# EAGLE design wand_alpha (EAGLE 9.5.2)
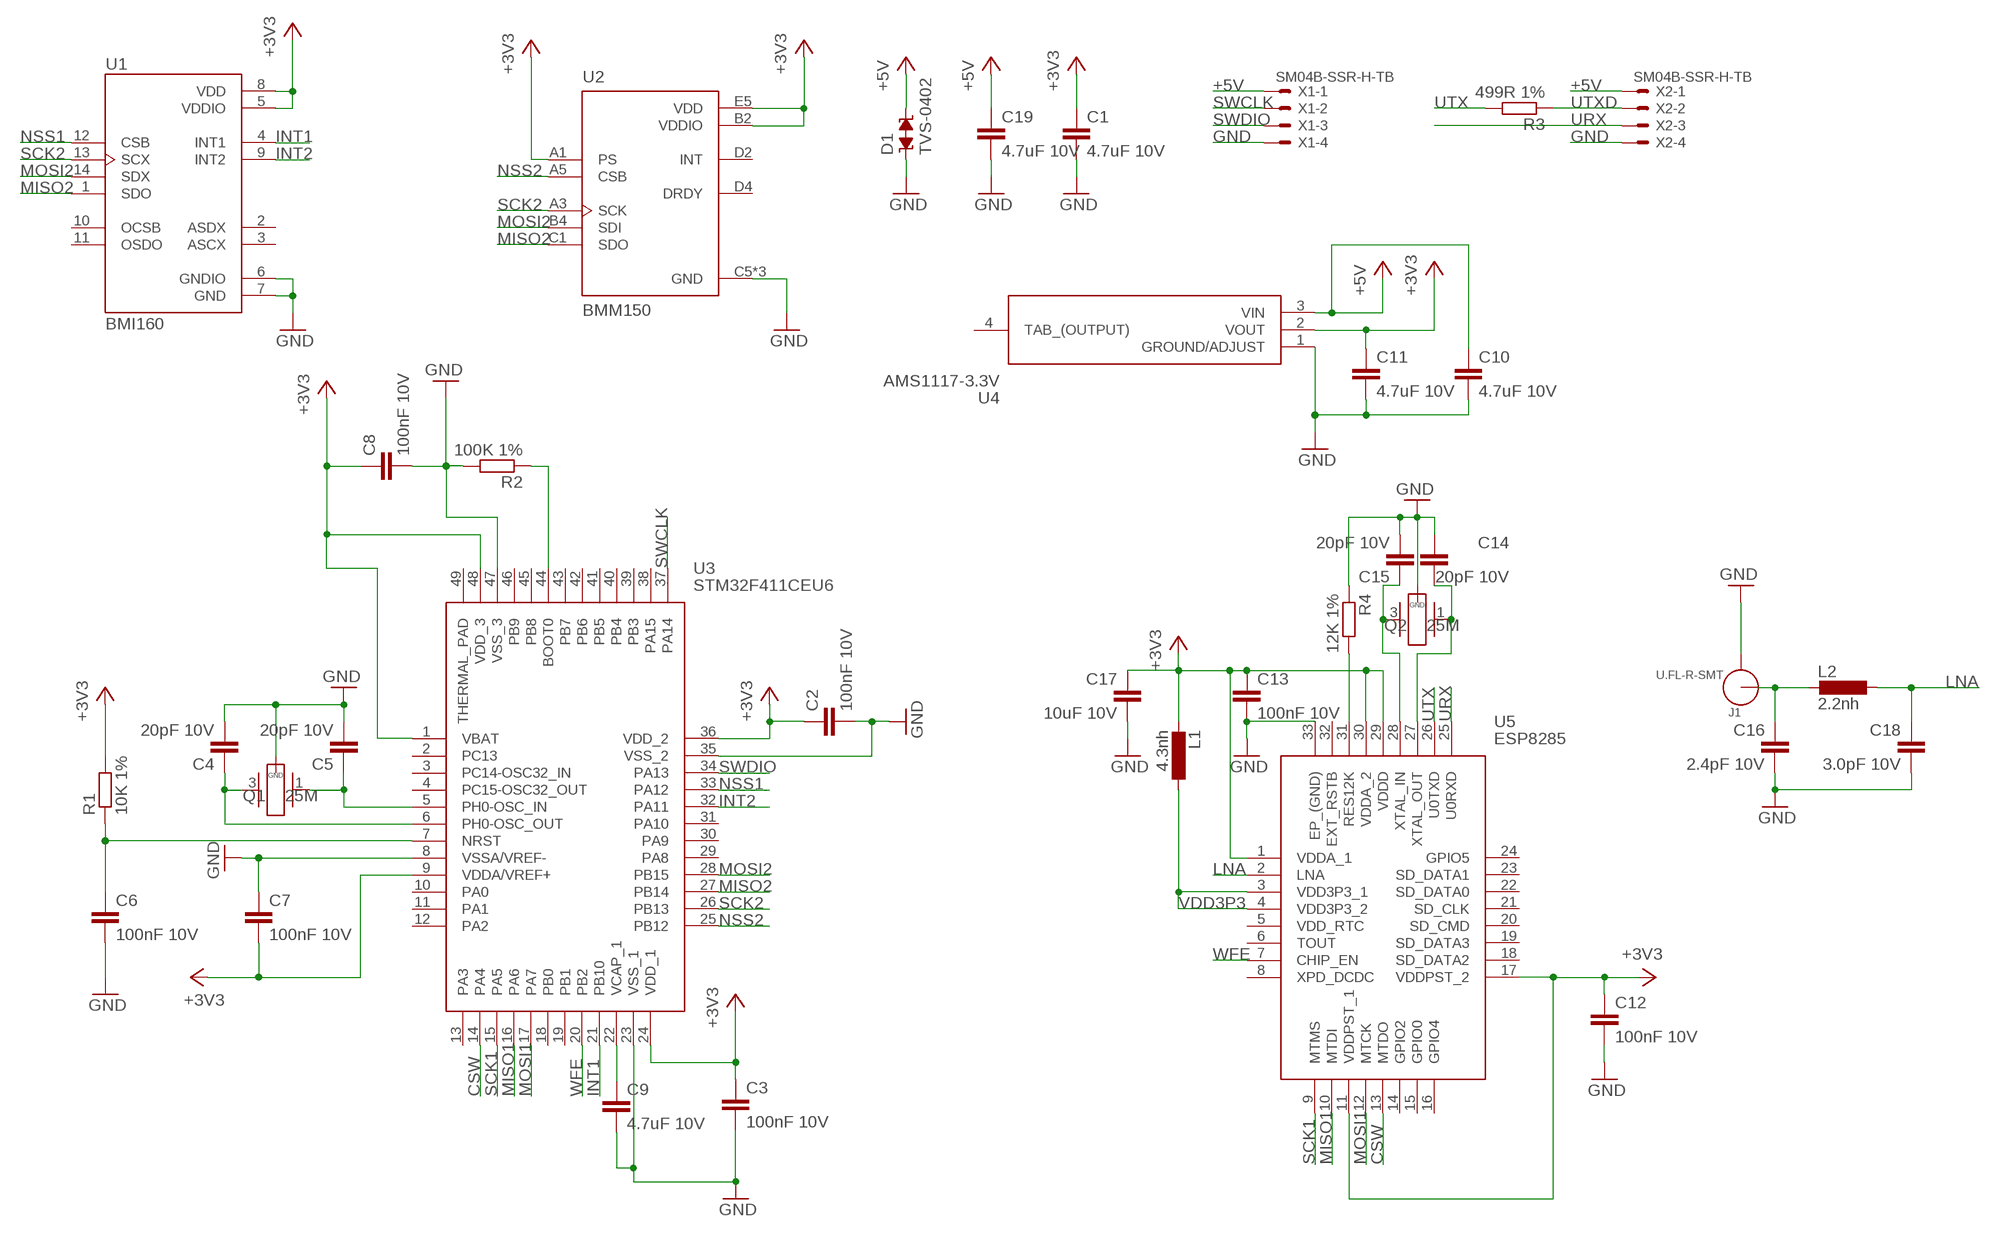
[diagram p0: schematic, sheet 1]

## Parts
C1  4.7uF 10V  C-EUC0402  [C0402]
C2  100nF 10V  C-EUC0402  [C0402]
C3  100nF 10V  C-EUC0402  [C0402]
C4  20pF 10V  C-EUC0402  [C0402]
C5  20pF 10V  C-EUC0402  [C0402]
C6  100nF 10V  C-EUC0402  [C0402]
C7  100nF 10V  C-EUC0402  [C0402]
C8  100nF 10V  C-EUC0402  [C0402]
C9  4.7uF 10V  C-EUC0402  [C0402]
C10  4.7uF 10V  C-EUC0402  [C0402]
C11  4.7uF 10V  C-EUC0402  [C0402]
C12  100nF 10V  C-EUC0402  [C0402]
C13  100nF 10V  C-EUC0402  [C0402]
C14  20pF 10V  C-EUC0402  [C0402]
C15  20pF 10V  C-EUC0402  [C0402]
C16  2.4pF 10V  C-EUC0402  [C0402]
C17  10uF 10V  C-EUC0402  [C0402]
C18  3.0pF 10V  C-EUC0402  [C0402]
C19  4.7uF 10V  C-EUC0402  [C0402]
D1  TVS-0402  [TVS0402]
J1  U.FL-R-SMT  [U.FL_SMT]
L1  4.3nh  L-EUL0402  [L0402]
L2  2.2nh  L-EUL0402  [L0402]
Q1  25M  FA-128  [FA-128]
Q2  25M  FA-128  [FA-128]
R1  10K 1%  R-EU_R0402  [R0402]
R2  100K 1%  R-EU_R0402  [R0402]
R3  499R 1%  R-EU_R0402  [R0402]
R4  12K 1%  R-EU_R0402  [R0402]
U1  BMI160  [PQFN50P300X250X88-14N]
U2  BMM150  [XDCR_BMM150]
U3  STM32F411CEU6  [QFN50P700X700X60-49N]
U4  AMS1117-3.3V  [SOT229P700X180-4N]
U5  ESP8285  [QFN50P500X500X90-33N]
X1  SM04B-SSR-H-TB  [SM04B-SSR-H-TB]
X2  SM04B-SSR-H-TB  [SM04B-SSR-H-TB]

## Nets
+3V3: C1.1 C2.1 C3.1 C7.2 C8.1 C11.1 C12.1 C13.1 C17.1 L1.2 R1.2 U1.5(VDDIO) U1.8(VDD) U2.A1(PS) U2.B2(VDDIO) U2.E5(VDD) U3.1(VBAT) U3.9(VDDA/VREF+) U3.24(VDD_1) U3.36(VDD_2) U3.48(VDD_3) U4.2(VOUT) U5.1(VDDA_1) U5.11(VDDPST_1) U5.17(VDDPST_2) U5.29(VDDD) U5.30(VDDA_2)
+5V: C10.1 C19.1 D1.2 U4.3(VIN) X1.1 X2.1
CSW: U3.14(PA4) U5.13(MTDO)
GND: C1.2 C2.2 C3.2 C4.2 C5.2 C6.2 C7.1 C8.2 C9.2 C10.2 C11.2 C12.2 C13.2 C14.2 C15.2 C16.2 C17.2 C18.2 C19.2 D1.1 J1.GND1 J1.GND2 Q1.2(GND) Q1.4(GND) Q2.2(GND) Q2.4(GND) R2.2 R4.1 U1.6(GNDIO) U1.7(GND) U2.C5(GND) U2.E1(GND) U2.E3(GND) U3.8(VSSA/VREF-) U3.23(VSS_1) U3.35(VSS_2) U3.47(VSS_3) U4.1(GROUND/ADJUST) U5.33(EP_(GND)) X1.4 X2.4
INT1: U1.4(INT1) U3.21(PB10)
INT2: U1.9(INT2) U3.32(PA11)
LNA: C18.1 L2.1 U5.2(LNA)
MISO1: U3.16(PA6) U5.10(MTDI)
MISO2: U1.1(SDO) U2.C1(SDO) U3.27(PB14)
MOSI1: U3.17(PA7) U5.12(MTCK)
MOSI2: U1.14(SDX) U2.B4(SDI) U3.28(PB15)
N$1: C4.1 Q1.3 U3.6(PH0-OSC_OUT)
N$2: C5.1 Q1.1 U3.5(PH0-OSC_IN)
N$3: C6.1 R1.1 U3.7(NRST)
N$4: R2.1 U3.44(BOOT0)
N$5: C9.1 U3.22(VCAP_1)
N$6: C16.1 J1.SIG(ANT) L2.2
N$7: C14.1 Q2.1 U5.27(XTAL_OUT)
N$8: C15.1 Q2.3 U5.28(XTAL_IN)
N$9: R4.2 U5.31(RES12K)
NSS1: U1.12(CSB) U3.33(PA12)
NSS2: U2.A5(CSB) U3.25(PB12)
SCK1: U3.15(PA5) U5.9(MTMS)
SCK2: U1.13(SCX) U2.A3(SCK) U3.26(PB13)
SWCLK: U3.37(PA14) X1.2
SWDIO: U3.34(PA13) X1.3
URX: U5.25(U0RXD) X2.3
UTX: R3.2 U5.26(U0TXD)
UTXD: R3.1 X2.2
VDD3P3: L1.1 U5.3(VDD3P3_1) U5.4(VDD3P3_2)
WFE: U3.20(PB2) U5.7(CHIP_EN)
Unconnected: U1.2(ASDX) U1.3(ASCX) U1.10(OCSB) U1.11(OSDO) U2.D2(INT) U2.D4(DRDY) U3.2(PC13) U3.3(PC14-OSC32_IN) U3.4(PC15-OSC32_OUT) U3.10(PA0) U3.11(PA1) U3.12(PA2) U3.13(PA3) U3.18(PB0) U3.19(PB1) U3.29(PA8) U3.30(PA9) U3.31(PA10) U3.38(PA15) U3.39(PB3) U3.40(PB4) U3.41(PB5) U3.42(PB6) U3.43(PB7) U3.45(PB8) U3.46(PB9) U3.49(THERMAL_PAD) U4.4(TAB_(OUTPUT)) U5.5(VDD_RTC) U5.6(TOUT) U5.8(XPD_DCDC) U5.14(GPIO2) U5.15(GPIO0) U5.16(GPIO4) U5.18(SD_DATA2) U5.19(SD_DATA3) U5.20(SD_CMD) U5.21(SD_CLK) U5.22(SD_DATA0) U5.23(SD_DATA1) U5.24(GPIO5) U5.32(EXT_RSTB)

## Library data of the parts
C1-C19 = rcl:C-EU: CAPACITOR, European symbol; SPICEPREFIX: C
D1 = supressor:TVS-: TVS BI-DIRECTIONAL
J1 = connector:U.FL-R-SMT: U.FL-R-SMT Antenna Connector; DIGIKEY: H122041-ND; MANUFACTURER: Hirose; MPN: U.FL-R-SMT-1(01)
L1 L2 = rcl-2:L-EU: INDUCTOR, European symbol
Q1 Q2 = crystals:FA-128: Epson MHz RANGE CRYSTAL UNIT ULTRA MINIATURE SIZE LOW PROFILE SMD http://www.digikey.com/product-search/en?FV=ffec63d1
R1-R4 = rcl:R-EU_: RESISTOR, European symbol; SPICEPREFIX: R
U1 = BMI160:BMI160: BMI160 2.5 x 3 mm Tiaxial Accelerometer / Gyroscope Inertial Measurement Unit; AVAILABILITY: Unavailable; DESCRIPTION: Accelerometer, Gyroscope, 6 Axis Sensor I²C, SPI Output; MF: Bosch; MP: BMI160; PACKAGE: LGA-14 Bosch; PRICE: None
U2 = BMM150:BMM150: BMM150 Series 3.6 V Surface Mount Three-Axis Geomagnetic Sensor - WLCSP-12; AVAILABILITY: Unavailable; DESCRIPTION: FlipCore, Hall Effect Sensor X, Y, Z Axis 12-WLCSP _1.56x1.56_; MF: Bosch Sensortec; MP: BMM150; PACKAGE: WLCSP-12 Bosch; PRICE: None
U3 = STM32F411CEU6:STM32F411CEU6: 32-Bit MCU 512K Flash 100MHz UFQFPN48 STMicroelectronics STM32F411CEU6, 32bit ARM Cortex M4 MCU, 100MHz, 512 kB Flash, 48-Pin UFQFPN Source: Datasheet <http://www.st.com/content/ccc/resource/technical/document/datasheet/b3/a5/46/3b/b4/e5/4c/85/DM00115249.pdf/files/DM00115249.pdf/jcr:content/translations/en.DM00115249.pdf>; DESCRIPTION: 32-Bit MCU 512K Flash 100MHz UFQFPN48 STMicroelectronics STM32F411CEU6, 32bit ARM Cortex M4 MCU, 100MHz, 512 kB Flash, 48-Pin UFQFPN; HEIGHT: 0.6mm; MANUFACTURER_NAME: STMicroelectronics; MANUFACTURER_PART_NUMBER: STM32F411CEU6; MOUSER_PART_NUMBER: 511-STM32F411CEU6; MOUSER_PRICE-STOCK: https://www.mouser.co.uk/ProductDetail/STMicroelectronics/STM32F411CEU6?qs=pjMTYa9MTGV3ou31YBFa3g%3D%3D
U4 = ams1117-3.3v:AMS1117-3.3V: 1A LOW DROPOUT VOLTAGE REGULATOR, SOT-223 Source: Datasheet <http://www.advanced-monolithic.com/pdf/ds1117.pdf>; DESCRIPTION: 1A LOW DROPOUT VOLTAGE REGULATOR, SOT-223; HEIGHT: 1.8mm; MANUFACTURER_NAME: Advanced Monolithic Systems; MANUFACTURER_PART_NUMBER: ams1117-3.3v
U5 = ESP8285:ESP8285: RF System on a Chip - SoC SMD IC ESP8285, 1MB SPI flash inside, QFN32-pin, 5x5mm Source: Datasheet <https://www.espressif.com/sites/default/files/documentation/0a-esp8285_datasheet_en.pdf>; DESCRIPTION: RF System on a Chip - SoC SMD IC ESP8285, 1MB SPI flash inside, QFN32-pin, 5x5mm; HEIGHT: 0.9mm; MANUFACTURER_NAME: Espressif Systems; MANUFACTURER_PART_NUMBER: ESP8285; MOUSER_PART_NUMBER: 356-ESP8285; MOUSER_PRICE-STOCK: https://www.mouser.co.uk/ProductDetail/Espressif-Systems/ESP8285?qs=chTDxNqvsyn49Ad%252BqWdhIQ%3D%3D
X1 X2 = con-jst2:SM04B-SSR-H-TB: Disconnectable Insulation displacement connector, 1.0mm pitch 4 contacts

## Board
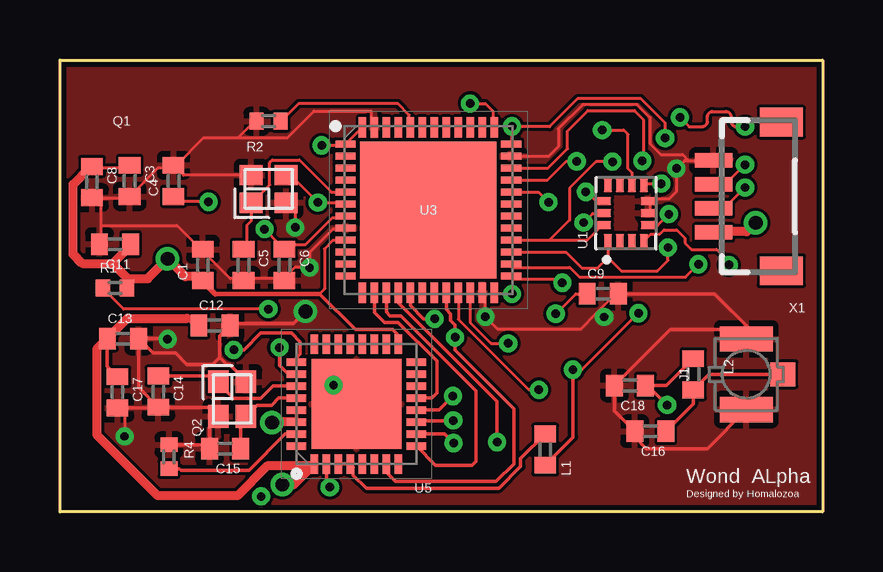
[diagram p1: board, top side]
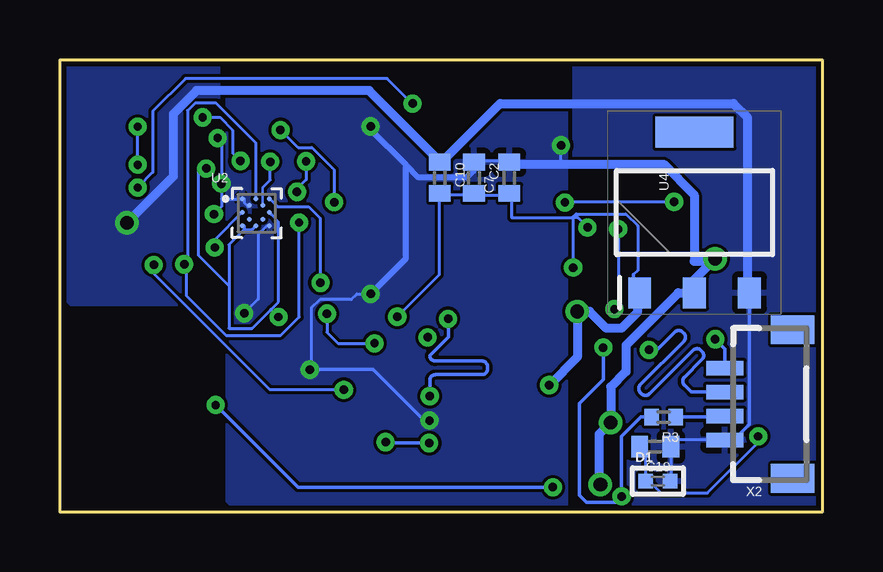
[diagram p2: board, bottom side, seen from below]

Size 31.8 x 18.85 mm. Coordinates in mm from the lower left corner, seen from the top.
Outline: 0,18.85 31.8,18.85 31.8,0 0,0 0,18.85
Copper layers (1*16): Top 0.035mm / dielectric 1.5mm / Bottom 0.035mm
Design rules "default *": minimum track width 4mil, minimum drill 0.35mm, track to track 5mil, track to pad 5mil, pad to pad 5.5mil, via to via 5.5mil, smd to smd 5mil, copper to edge 8mil, drill to drill 8mil, minimum pad ring 10mil, minimum via ring 8mil, stop-mask expansion 4mil, vias tented up to drill 0mil, thermal gap 10mil

### Footprints (pad centres in the part's own frame; a part is rotated, then mirrored left to right if it is on the bottom)
C0402 = smd 0.7 x 0.9: 1 -0.65,0; 2 0.65,0
TVS0402 = smd 0.6 x 0.6: 1 -0.508,0; 2 0.508,0
U.FL_SMT = smd 1.05 x 2.2: GND1 -1.475,0; GND2 1.475,0 | smd 1 x 1.05: SIG 0,-1.525
L0402 = smd 0.7 x 0.9: 1 -0.65,0; 2 0.65,0
FA-128 = smd 0.95 x 0.85: 1 -0.725,-0.575; 2 0.725,-0.575; 3 0.725,0.575; 4 -0.725,0.575
R0402 = smd 0.6 x 0.7: 1 -0.5,0; 2 0.5,0
PQFN50P300X250X88-14N = smd 0.59 x 0.35: 1 -1.165,0.75; 2 -1.165,0.25; 3 -1.165,-0.25; 4 -1.165,-0.75; 8 1.165,-0.75; 9 1.165,-0.25; 10 1.165,0.25; 11 1.165,0.75 | smd 0.35 x 0.59: 5 -0.5,-0.915; 6 0,-0.915; 7 0.5,-0.915; 12 0.5,0.915; 13 0,0.915; 14 -0.5,0.915
XDCR_BMM150 = smd 0.2 x 0.2: A1 -0.601,0.601; A3 -0.035,0.601; A5 0.531,0.601; B2 -0.318,0.318; B4 0.248,0.318; C1 -0.601,0.035; C5 0.531,0.035; D2 -0.318,-0.248; D4 0.248,-0.248; E1 -0.601,-0.531; E3 -0.035,-0.531; E5 0.531,-0.531
QFN50P700X700X60-49N = smd 0.85 x 0.3: 1 -3.45,2.75; 2 -3.45,2.25; 3 -3.45,1.75; 4 -3.45,1.25; 5 -3.45,0.75; 6 -3.45,0.25; 7 -3.45,-0.25; 8 -3.45,-0.75; 9 -3.45,-1.25; 10 -3.45,-1.75; 11 -3.45,-2.25; 12 -3.45,-2.75; 25 3.45,-2.75; 26 3.45,-2.25; 27 3.45,-1.75; 28 3.45,-1.25; 29 3.45,-0.75; 30 3.45,-0.25; 31 3.45,0.25; 32 3.45,0.75; 33 3.45,1.25; 34 3.45,1.75; 35 3.45,2.25; 36 3.45,2.75 | smd 0.3 x 0.85: 13 -2.75,-3.45; 14 -2.25,-3.45; 15 -1.75,-3.45; 16 -1.25,-3.45; 17 -0.75,-3.45; 18 -0.25,-3.45; 19 0.25,-3.45; 20 0.75,-3.45; 21 1.25,-3.45; 22 1.75,-3.45; 23 2.25,-3.45; 24 2.75,-3.45; 37 2.75,3.45; 38 2.25,3.45; 39 1.75,3.45; 40 1.25,3.45; 41 0.75,3.45; 42 0.25,3.45; 43 -0.25,3.45; 44 -0.75,3.45; 45 -1.25,3.45; 46 -1.75,3.45; 47 -2.25,3.45; 48 -2.75,3.45 | smd 5.7 x 5.7: 49 0,0
SOT229P700X180-4N = smd 1.3 x 0.95: 1 -3.35,2.29; 2 -3.35,0; 3 -3.35,-2.29 | smd 1.3 x 3.25: 4 3.35,0
QFN50P500X500X90-33N = smd 0.8 x 0.3: 1 -2.5,1.75; 2 -2.5,1.25; 3 -2.5,0.75; 4 -2.5,0.25; 5 -2.5,-0.25; 6 -2.5,-0.75; 7 -2.5,-1.25; 8 -2.5,-1.75; 17 2.5,-1.75; 18 2.5,-1.25; 19 2.5,-0.75; 20 2.5,-0.25; 21 2.5,0.25; 22 2.5,0.75; 23 2.5,1.25; 24 2.5,1.75 | smd 0.3 x 0.8: 9 -1.75,-2.5; 10 -1.25,-2.5; 11 -0.75,-2.5; 12 -0.25,-2.5; 13 0.25,-2.5; 14 0.75,-2.5; 15 1.25,-2.5; 16 1.75,-2.5; 25 1.75,2.5; 26 1.25,2.5; 27 0.75,2.5; 28 0.25,2.5; 29 -0.25,2.5; 30 -0.75,2.5; 31 -1.25,2.5; 32 -1.75,2.5 | smd 3.75 x 3.75: 33 0,0
SM04B-SSR-H-TB = smd 0.6 x 1.55: 1 -1.5,1.925; 2 -0.5,1.925; 3 0.5,1.925; 4 1.5,1.925 | smd 1.2 x 1.8: FIT@1 -3.1,-0.9; FIT@2 3.1,-0.9

### Placement (x,y rotation side)
C1  5.96,10.3 90 top
C2  14.54,13.93 270 bottom
C3  2.91,13.8 270 top
C4  4.74,13.8 90 top
C5  7.66,10.3 270 top
C6  9.36,10.3 270 top
C7  13.07,13.93 90 bottom
C8  1.33,13.75 270 top
C9  22.63,9.09 0 top
C10  15.96,13.93 270 bottom
C11  2.3,11.16 180 top
C12  6.44,7.77 0 top
C13  2.63,7.23 0 top
C14  4.1,5.02 270 top
C15  6.88,2.64 180 top
C16  24.61,3.37 180 top
C17  2.4,4.99 270 top
C18  23.76,5.27 180 top
C19  6.99,2.72 180 bottom
D1  6.87,1.28 0 bottom
J1  28.61,5.74 90 top
L1  20.23,2.6 270 top
L2  26.4,5.74 270 top
Q1  8.7,13.47 0 top
Q2  7.18,4.7 270 top
R1  2.3,9.33 0 top
R2  8.7,16.29 180 top
R3  6.63,3.95 180 bottom
R4  4.55,2.3 270 top
U1  23.6,12.46 90 top
U2  23.6,12.46 0 bottom
U3  15.35,12.59 0 top
U4  5.35,12.48 90 bottom
U5  12.36,4.5 90 top
X1  29.17,13.16 90 top
X2  2.16,4.5 90 bottom

### Tracks (layer width: path | path; a pad name or v marks a point on that pad's centre or on a via)
+3V3  (via drill 0.35, 0.57)
  Top 0.127: C3.1 2.82,14.34 1.38,14.34 C8.1 1.23,14.33 | 2.81,9.73 2.81,9.41 R1.2 | U3.9 11.86,11.32 11.37,11.32 11.02,10.97 11.02,9.3 10.82,9.09 | 5.99,9.57 C1.1 | v25.07,13.68 24.43,13.68 U1.8 | v25.39,12.41 24.91,11.94 24.59,11.94 U1.5 | U3.48 12.5,15.92 12.02,15.44 U3.1 11.86,15.28 v10.91,15.28 | v18.85,9.09 18.21,9.09 U3.24 | v25.23,15.59 25.23,16.22 24.2,17.25 21.6,17.25 20.41,16.07 18.86,16.07 v18.85,16.08 18.85,15.38 U3.36 | v24.12,8.29 21.76,5.93 v21.39,5.93 | 10.82,9.09 10.81,9.08 | 10.83,9.09 10.82,9.09
  Top 0.152: C13.1 1.98,6.06 C17.1 | C12.1 5.59,7.78 5.3,8.07 | 10.83,9.09 12.32,7.61 13.86,7.61 14.1,7.38 14.1,7.01 U5.17 | U5.30 U5.29 | 8.87,3.75 v8.84,3.72 | U5.11 14.91,3.8 16.39,3.8 v16.4,3.81 | L1.2 21.39,3.11 v21.39,5.93 | v9.27,1.14 v9.27,1.15 | 10.53,1.92 U5.1 | R1.2 2.87,9.41 3.19,9.73 3.55,9.73
  Top 0.178: 10.81,9.08 6.48,9.08
  Top 0.203: 6.48,9.08 5.99,9.57
  Top 0.381: 1.23,14.33 0.55,13.65 0.55,10.74 0.93,10.36 2.2,10.36 | 2.81,9.73 3.55,9.73 3.66,9.73 v4.49,10.56 5.24,9.81 5.8,9.81 C1.1 | C13.1 2.81,8.07 5.3,8.07 | 10.53,1.92 8.64,1.92 7.4,0.68 4.08,0.68 1.54,3.21 1.54,6.79 C13.1 | U5.30 8.87,3.75 | U5.1 9.76,1.15 v9.27,1.15 | 2.2,10.36 2.95,11.12 C11.1 | 2.2,10.36 2.87,9.69 2.87,9.41
  Bottom 0.127: U2.B2 23.96,12.73 24.12,12.89 24.12,13.05 U2.A1 24.28,13.05 25.07,13.05 | 25.07,13.05 v25.07,13.68 25.07,15.43 v25.23,15.59 | v25.39,12.41 25.07,12.73 25.07,13.05 | v24.12,8.29 23.53,8.87 23.53,11.57 23.16,11.94 U2.E5 | 14.56,14.49 C2.1 14.4,14.65 13.13,14.65 C7.2 12.98,14.49 | 10.91,14.49 10.91,14.5 v10.91,15.28 | 4.59,10.46 v4.49,10.56 | v18.85,9.09 19.42,9.09 19.66,8.86 20.96,8.86 21.3,8.52 21.3,6.02 v21.39,5.93
  Bottom 0.152: v16.4,3.81 16.63,3.81 18.75,5.93 v21.39,5.93
  Bottom 0.254: 17.39,14.49 18.85,15.95 v18.85,16.08 | 17.39,14.49 16.84,13.94 14.85,13.94 14.56,14.23 14.56,14.49 | v18.85,9.09 17.39,10.55 17.39,14.49
  Bottom 0.381: 12.98,14.49 10.91,14.49 | 10.91,14.5 6.63,14.5 5.35,13.22 5.35,10.46 4.59,10.46 | v9.27,1.14 9.32,1.19 9.32,3.24 v8.84,3.72 8.84,5.21 8.2,5.85 8.2,6.95 6.02,9.13 U4.2 5.35,9.7 v4.49,10.56
  pour Bottom: 10.68,18.56 10.68,0.29 24.68,0.29 24.83,0.44 24.83,18.44 24.7,18.56
+5V  (via drill 0.57)
  Top 0.381: v29.01,12.06 28.63,11.68 27.26,11.68 X1.1
  Bottom 0.127: U4.3 3.13,9.25 | X2.1 6.06,3 C19.1 6.33,1.31 D1.2
  Bottom 0.152: X2.1 3.7,3 3.06,3.64 U4.3
  Bottom 0.381: v29.01,12.06 27.08,13.98 27.08,16.6 26.11,17.57 18.91,17.57 15.99,14.65 C10.1 15.83,14.65 13.45,17.03 3.72,17.03 3.13,16.44 3.13,9.25
  pour Bottom: 0.18,18.69 0.18,0.34 0.3,0.21 9.98,0.21 10.38,0.61 10.38,18.69
  pour Bottom: 31.58,18.59 25.18,18.59 25.18,9.04 25.56,8.66 31.36,8.66 31.69,8.99 31.69,18.47
CSW
  Top 0.152: U5.13 15.5,4.75 15.71,4.95 15.71,6.29 14.1,7.9 13.53,7.9 13.1,8.32 U3.14
GND  (via drill 0.35, 0.57)
  Top 0.127: 9.32,9.73 9.78,10.19 v10.41,10.19 10.41,10.81 11.39,11.79 11.86,11.79 U3.8 | 9.32,9.73 7.73,9.73 C5.2 7.58,9.73 7.1,9.73 5.99,10.84 C1.2 5.83,11 4.88,11.95 1.7,11.95 | 9.32,9.73 C6.2 | 1.7,13.06 2.81,13.06 C3.2 2.97,13.22 4.08,14.33 4.72,14.33 C4.2 | 1.7,13.06 1.38,13.06 C8.2 1.7,13.06 | 1.7,13.06 1.7,11.95 | 1.7,11.95 1.7,11.32 C11.2 | 7.42,15.6 8.05,16.24 R2.2 | 7.42,15.6 5.99,15.6 4.88,14.49 C4.2 | 7.42,15.6 9.48,15.6 10.59,16.71 12.97,16.71 12.97,16.08 U3.47 | U1.6 24.59,12.57 24.59,12.89 U1.7 24.59,13.05 25.39,13.05 25.7,13.37 v25.7,14.32 26.04,14.66 26.2,14.66 | 22.37,8.29 23.16,9.08 C9.2 | 22.37,8.29 21.71,7.63 18.25,7.63 v17.74,8.14 17.74,9.09 U3.23 | v22.69,8.13 22.65,8.13 22.62,8.1 22.6,8.1 22.42,8.29 22.37,8.29 | U3.35 18.82,14.82 20.37,14.82 20.78,15.23 20.78,15.98 21.79,16.99 24.05,16.99 24.6,16.45 24.6,15.35 25.05,14.9 25.96,14.9 26.2,14.66 | 26.2,14.66 X1.4 | C4.2 5.16,14.04 7.96,14.04 Q1.4 | Q1.2 9.8,12.52 v9.8,11.86 | C17.2 2.69,4.05 v2.69,3.15
  Top 0.152: C14.2 6.21,4.37 Q2.2 6.23,3.61 6.23,2.78 | C15.2 6.23,2.78 | R4.1 6.22,2.8 6.23,2.78 | C14.2 3.28,5.19 C13.2 | v10.24,8.36 9.73,7.85 7.17,7.85 C12.2 6.65,7.34 6.65,6.45 | C13.2 3.88,6.62 4.82,6.62 5.29,6.15 6.36,6.15 6.65,6.45 | U5.33 12.19,4.5 v11.4,5.28 | C17.2 4.08,4.34 C14.2 | C9.2 27.28,9.09 28.77,7.6 28.23,7.6 | 28.23,7.6 J1.GND2 | 28.23,7.6 25.44,7.6 C18.2 23.11,4.22 C16.2 23.96,3.13 24.45,2.64 26.98,2.64 J1.GND1 | C13.2 4.46,7.23 v4.48,7.2 | Q2.4 7.75,5.47 7.08,6.15 6.96,6.15 6.65,6.45
  Bottom 0.127: 24.12,11.78 23.8,11.78 U2.E3 | 24.12,11.78 24.12,11.94 U2.E1 | 23.01,8.45 23.8,7.65 24.75,7.65 24.75,9.42 | 23.01,8.45 22.69,8.76 22.69,12.1 23.01,12.41 U2.C5 | 24.75,9.42 24.75,11.14 24.12,11.78 | v22.69,8.13 23.01,8.45 | 7.73,9.25 7.89,9.41 7.89,9.89 7.71,10.07 7.71,11.93 8.21,12.43 10.27,12.43 10.43,12.27 | 10.43,12.27 12.97,12.27 12.97,13.22 C7.1 13.13,13.22 14.4,13.22 C2.2 14.56,13.22 15.83,13.22 C10.2 15.99,13.22 15.99,9.89 v17.74,8.14 | 10.43,12.27 10.41,12.27 | v25.7,14.32 25.81,14.22 25.98,14.22 26.02,14.18 26.02,10.69 24.75,9.42 | 10.41,12.27 v10.41,10.19 | v9.8,11.86 10.21,12.27 10.41,12.27 | C19.2 7.38,2.46 D1.1 7.23,1.28 6.74,0.79 4.81,0.79 2.69,2.91 v2.69,3.15
  Bottom 0.152: v4.48,7.2 4.08,6.8 X2.4 | 7.89,9.89 7.89,9.39 U4.1
  Bottom 0.381: v11.4,5.28 10.24,6.45 v10.24,8.36 10.23,8.36 9.73,8.36 9.01,7.65 8.4,7.65 7.73,8.31 7.73,9.25
  pour Top (isolate 0.012): 0.2,18.6 0.2,0.1 31.7,0.1 31.8,0 31.8,18.45 31.65,18.6
INT1  (via drill 0.35)
  Top 0.127: U1.4 24.63,11.58 25,11.58 25.18,11.76 25.72,11.76 26.06,11.42 26.06,11.21 26.33,10.95 27.38,10.95 27.89,10.44 v27.89,10.3 | U3.21 16.6,8.03 19.55,5.09 v19.96,5.09
  Bottom 0.127: v27.89,10.3 27.89,9.93 23.06,5.1 19.97,5.1 v19.96,5.09
INT2  (via drill 0.35)
  Top 0.127: U1.9 23.85,14.14 23.69,14.31 23.69,15.75 23.51,15.93 v22.61,15.93 | U3.32 19.95,13.34 v20.37,12.92
  Bottom 0.127: v22.61,15.93 21.88,15.2 21.3,15.2 20.37,14.27 v20.37,12.92
LNA  (via drill 0.35)
  Top 0.152: L2.1 25.28,5.27 C18.1 24.5,5.27 v25.31,4.46 | U5.2 11.11,1.17 v11.25,1.03
  Bottom 0.152: v11.25,1.03 21.88,1.03 v25.31,4.46
MISO1  (via drill 0.35)
  Top 0.152: U3.16 14.11,9.13 14.11,8.71 18.22,4.6 v18.22,2.91 | U5.10 16.03,3.25 v16.41,2.87
  Bottom 0.152: v16.41,2.87 18.19,2.87 v18.22,2.91
MISO2  (via drill 0.35)
  Top 0.127: v25.35,11.02 25.35,10.49 24.91,10.05 23.41,10.05 22.85,10.6 | U3.27 18.82,10.82 21.11,10.82 21.77,10.16 22.42,10.16 22.85,10.59 22.85,10.6 | 22.85,10.6 22.85,11.18 U1.1
  Bottom 0.127: U2.C1 25.35,11.34 v25.35,11.02
MOSI1  (via drill 0.35)
  Top 0.152: U5.12 15.8,4.25 v16.38,4.83 | U3.17 14.6,8.61 15.16,8.05 v15.62,8.05
  Bottom 0.152: v16.38,4.83 16.38,5.49 arc90 16.15,5.72 14.21,5.72 arc-90 13.97,5.96 13.97,6.06 arc-90 14.21,6.29 16.15,6.29 arc90 16.38,6.53 15.61,7.3 v15.61,8.04 v15.62,8.05
MOSI2  (via drill 0.35)
  Top 0.127: v23.04,14.61 22.35,14.61 21.24,13.49 21.24,12.16 20.41,11.33 | 20.41,11.33 20.4,11.32 18.82,11.32 U3.28 | 20.41,11.33 21.98,11.33 22.59,11.94 U1.14
  Bottom 0.109: U2.B4 23.35,13.53
  Bottom 0.127: 23.35,13.53 23.04,13.84 v23.04,14.61
N$1  (via drill 0.35)
  Top 0.127: U3.6 11.86,12.9 v10.75,12.9 9.61,14.05 Q1.3 | v6.19,12.93 5.01,12.93 4.88,13.06 C4.1
  Bottom 0.127: v6.19,12.93 10.72,12.93 v10.75,12.9
N$2
  Top 0.127: C5.1 7.79,11.03 7.79,11.94 7.97,12.13 Q1.1 8.01,12.9 8.74,13.63 8.74,14.55 8.86,14.67 9.98,14.67 11.32,13.34 U3.5
N$3  (via drill 0.35)
  Top 0.127: v8.69,8.46 2.65,8.46 1.86,9.25 R1.1 | 9.16,11.16 9.32,11 C6.1 9.16,11.16 | 9.16,11.16 v8.53,11.79 | 9.16,11.16 10.25,11.16 11.36,12.27 11.86,12.27 U3.7
  Bottom 0.127: v8.69,8.46 8.53,8.62 v8.53,11.79
N$4
  Top 0.127: R2.1 9.32,16.4 9.96,17.03 14.08,17.03 14.56,16.55 14.56,16.08 U3.44
N$5  (via drill 0.35)
  Top 0.127: v18.69,7.03 17.97,7.03 17.1,7.9 17.1,9.09 U3.22 | v20.67,8.26 21.5,9.09 C9.1
  Bottom 0.127: v20.67,8.26 20.67,7.49 20.21,7.03 v18.69,7.03
N$6
  Top 0.152: J1.SIG 27.05,5.74 L2.2 26.4,4.51 C16.1
N$7
  Top 0.152: U5.27 8.88,5.25 8.37,4.73 7.23,4.73 6.6,5.36 Q2.1 6.36,5.67 C14.1
N$8
  Top 0.152: C15.1 7.53,3.76 Q2.3 8.22,4.45 8.82,4.45 9.12,4.75 U5.28
N$9
  Top 0.152: R4.2 4.98,1.8 5.04,1.74 7.88,1.74 9.39,3.25 U5.31
NSS1  (via drill 0.35)
  Top 0.127: U1.12 22.34,12.96 22,13.3 21.97,13.3 v21.92,13.35 | U3.33 20.32,13.84 21.1,14.62 v21.54,14.62
  Bottom 0.127: v21.54,14.62 21.54,13.86 21.92,13.47 v21.92,13.35
NSS2  (via drill 0.35)
  Top 0.127: v20.94,9.56 20.78,9.72 18.85,9.72 U3.25
  Bottom 0.127: v20.94,9.56 20.94,12.23 21.44,12.73 22.74,12.73 U2.A5
SCK1
  Top 0.152: U3.15 13.6,8.33 13.76,8.18 14.21,8.18 17.34,5.05 17.34,2.1 17.18,1.95 15.66,1.95 U5.9
SCK2  (via drill 0.35)
  Top 0.127: v26.62,10.32 26.08,9.79 21.67,9.79 21.26,10.19 18.85,10.19 U3.26 | v21.83,12.06 22.21,12.45 22.59,12.45 U1.13
  Bottom 0.127: U2.A3 23.64,13.05 23.64,15.4 25.29,17.05 26.16,17.05 26.48,16.73 26.48,10.6 26.62,10.46 v26.62,10.32 26.53,10.29 26.53,9.02 24.88,7.37 22.59,7.37 21.83,8.13 v21.83,12.06
SWCLK  (via drill 0.35)
  Top 0.127: v17.1,17.03 17.73,17.03 18.05,16.71 18.05,16.08 U3.37 | v28.56,13.53 27.77,12.73 27.29,12.73 X1.2
  Bottom 0.127: v17.1,17.03 17.11,17.03 18.16,18.07 26.56,18.07 27.93,16.71 27.93,14.16 v28.56,13.53
SWDIO  (via drill 0.35)
  Top 0.127: v25.85,16.45 26.24,16.07 26.77,16.07 arc90 26.99,16.29 26.99,16.48 arc-90 27.22,16.7 27.76,16.7 arc-90 27.98,16.48 27.98,16.29 arc90 28.2,16.07 v28.56,16.07 | v28.56,14.48 27.77,13.68 27.29,13.68 X1.3 | U3.34 18.99,14.32 20.33,14.32 21.16,15.14 21.16,15.89 22.01,16.74 23.95,16.74 24.32,16.37 24.32,14.68 v24.28,14.64
  Bottom 0.127: v24.28,14.64 24.59,14.95 24.59,15.92 25.13,16.45 v25.85,16.45 | v28.56,14.48 v28.56,16.07
URX  (via drill 0.35)
  Top 0.152: v7.25,6.76 7.68,6.76 8.37,7.45 9.66,7.45 10.02,7.09 10.02,6.59 9.86,6.43 U5.25
  Bottom 0.152: v7.25,6.76 arc-90 6.91,6.76 6.17,7.5 arc90 5.84,7.5 5.79,7.45 arc90 5.79,7.12 7.61,5.31 arc-90 7.61,4.97 7.56,4.93 arc-90 7.22,4.93 5.41,6.74 arc90 5.08,6.74 5.03,6.69 arc90 5.03,6.36 5.77,5.62 arc-90 5.77,5.28 5.48,5 X2.3
UTX  (via drill 0.35)
  Top 0.152: v9.15,6.85 9.15,6.12 9.52,5.75 U5.26
  Bottom 0.152: R3.2 7.59,3.95 8.38,3.16 v8.38,0.65 8.64,0.39 9.86,0.39 10.14,0.68 10.14,4.53 9.15,5.52 v9.15,6.85
UTXD
  Bottom 0.152: X2.2 4.13,3.95 R3.1
VDD3P3
  Top 0.152: L1.1 19.2,2.23 19.2,1.89 18.3,0.99 12.77,0.99 12.23,1.53 12.23,1.87 U5.4 U5.3
WFE  (via drill 0.35)
  Top 0.152: U3.20 16.12,9.12 16.12,8.43 16.29,8.26 16.29,7.97 16.47,7.79 v16.47,7.28 16.47,6.75 18.92,4.29 18.92,2.01 18.18,1.27 13.99,1.27 13.61,1.65 U5.7

### Text on the board
tPlace: Designed by Homalozoa | Wond ALpha